# EasyEDA Pro project Circuito Logico NOT.eprj

# Schematic Schematic1

## Sheets
1 P1: Board Name: Board1; Create Date: 2025-03-28; Page Name: P1; Project Name: Circuito Logico NOT; Schematic Name: Schematic1; Update Date: 2025-03-28
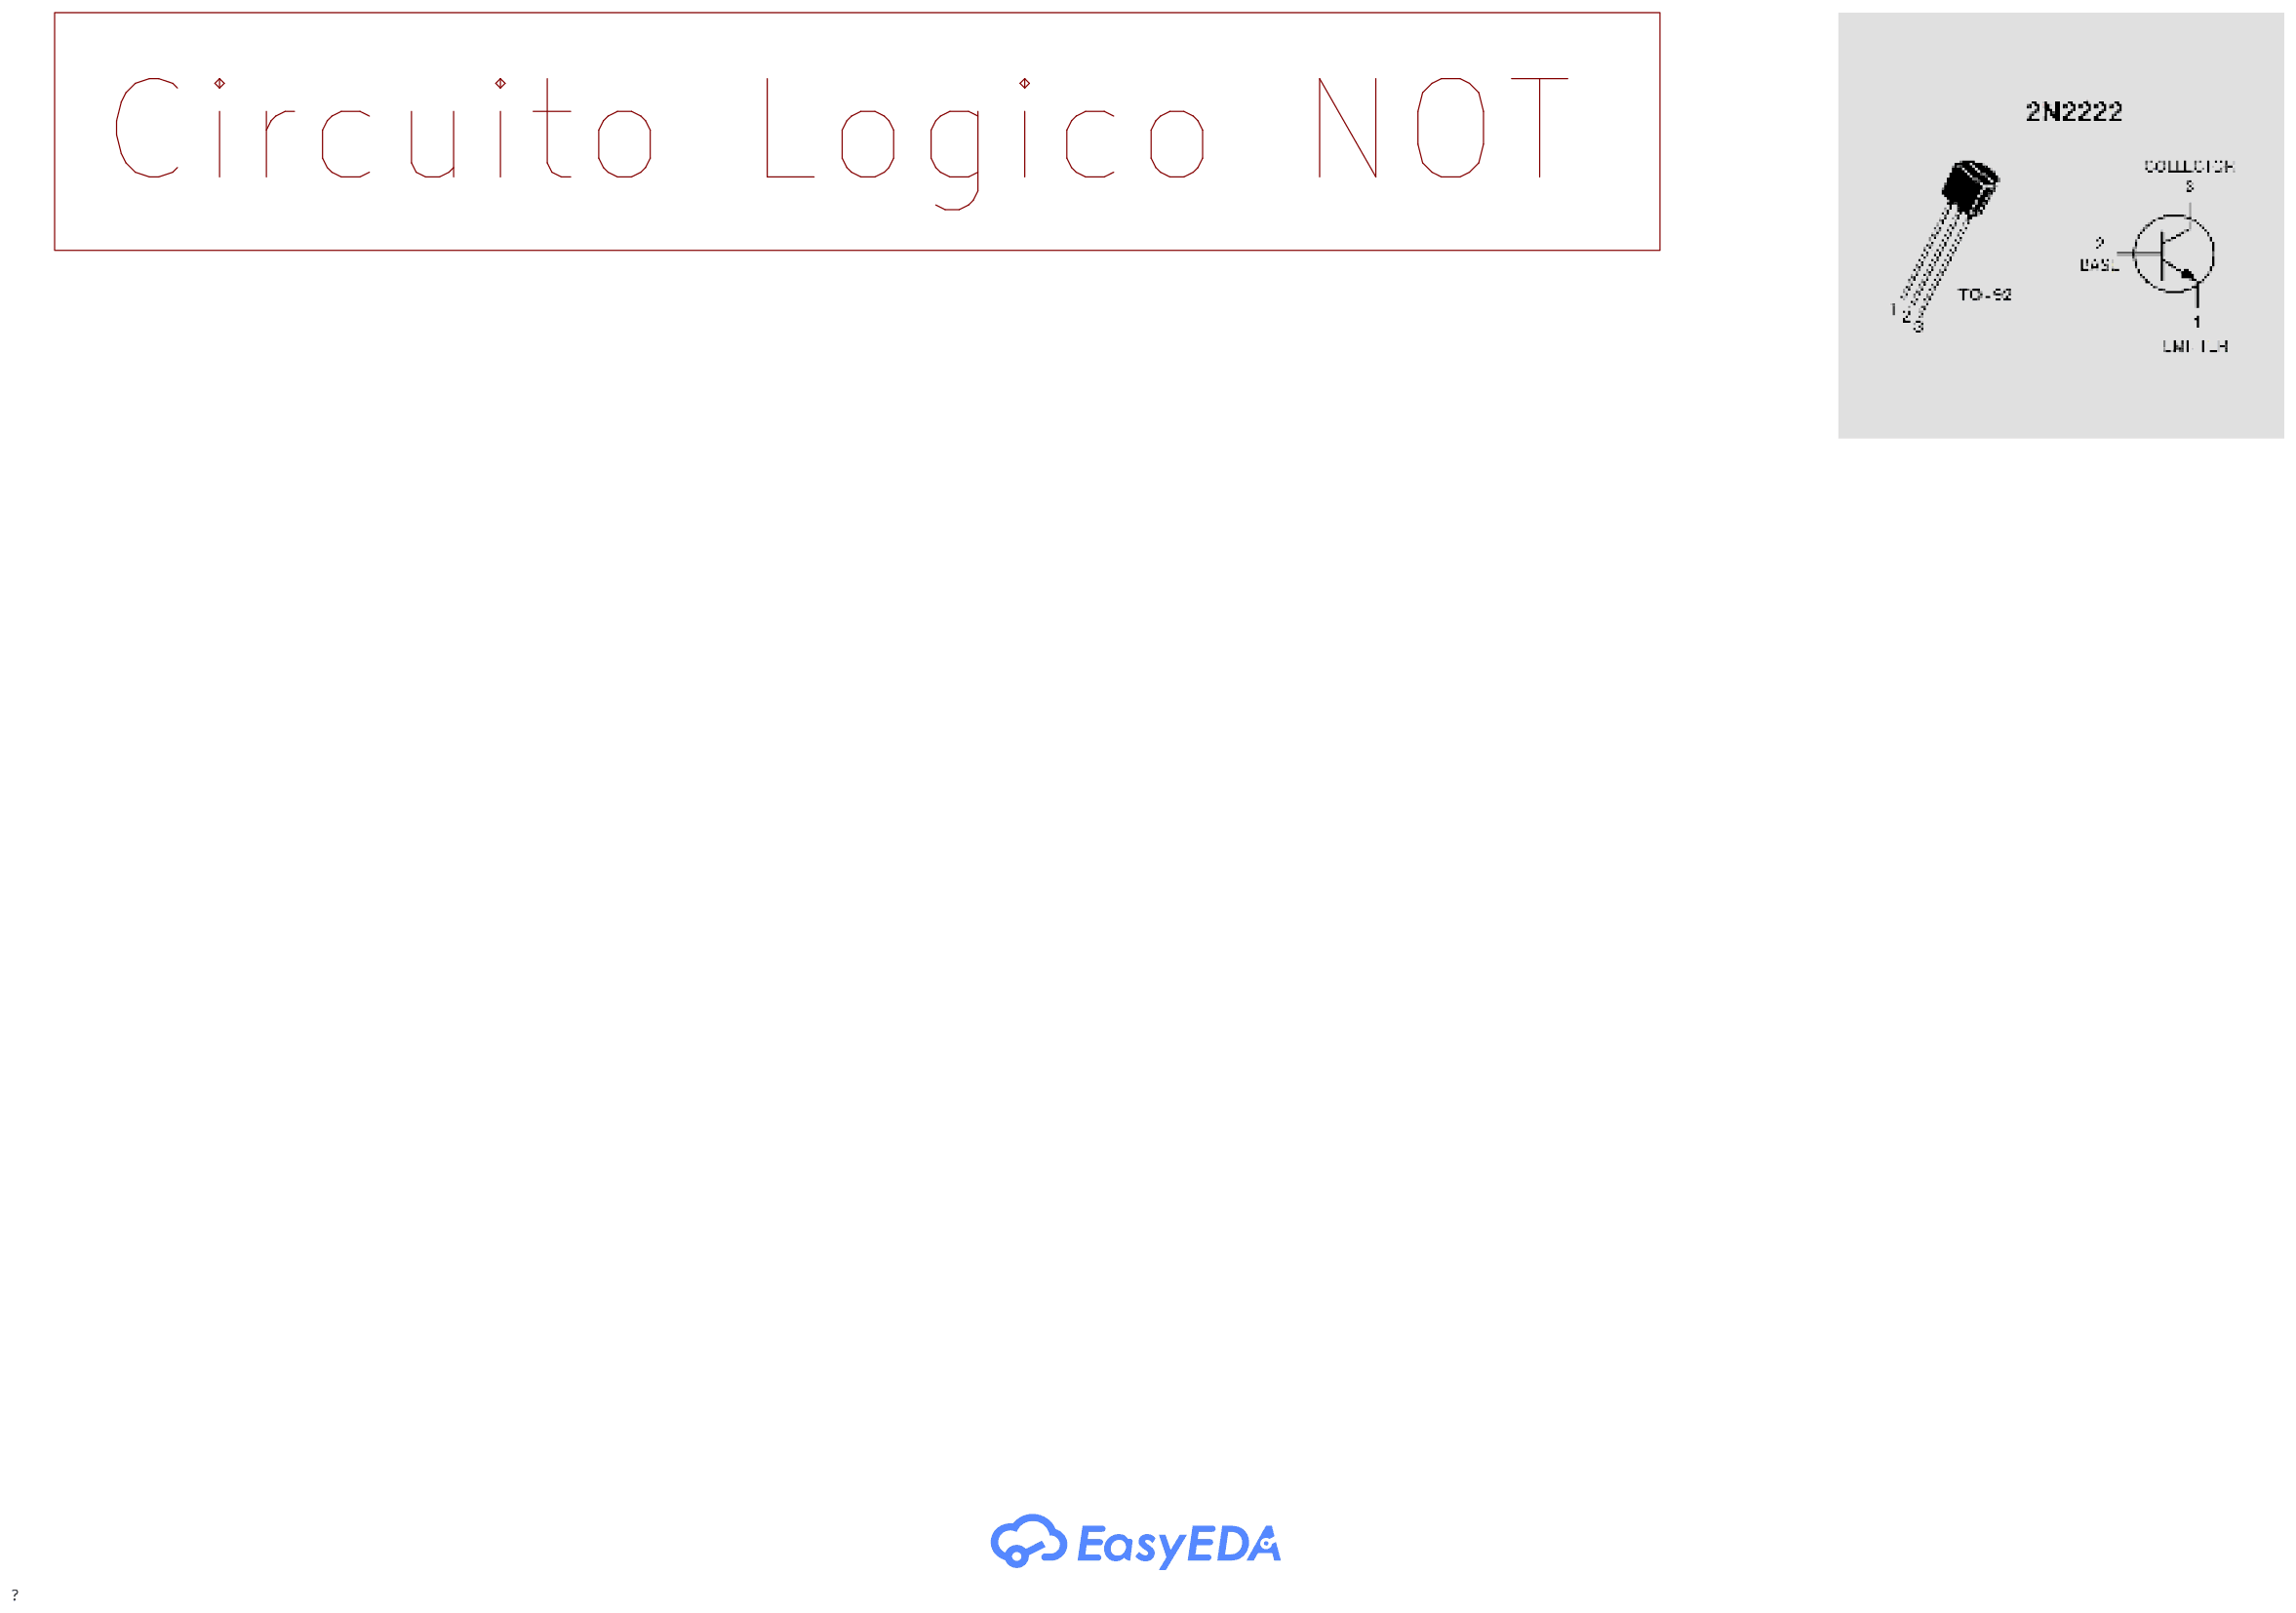
[diagram p0: P1]
2 P2: Page Name: P2
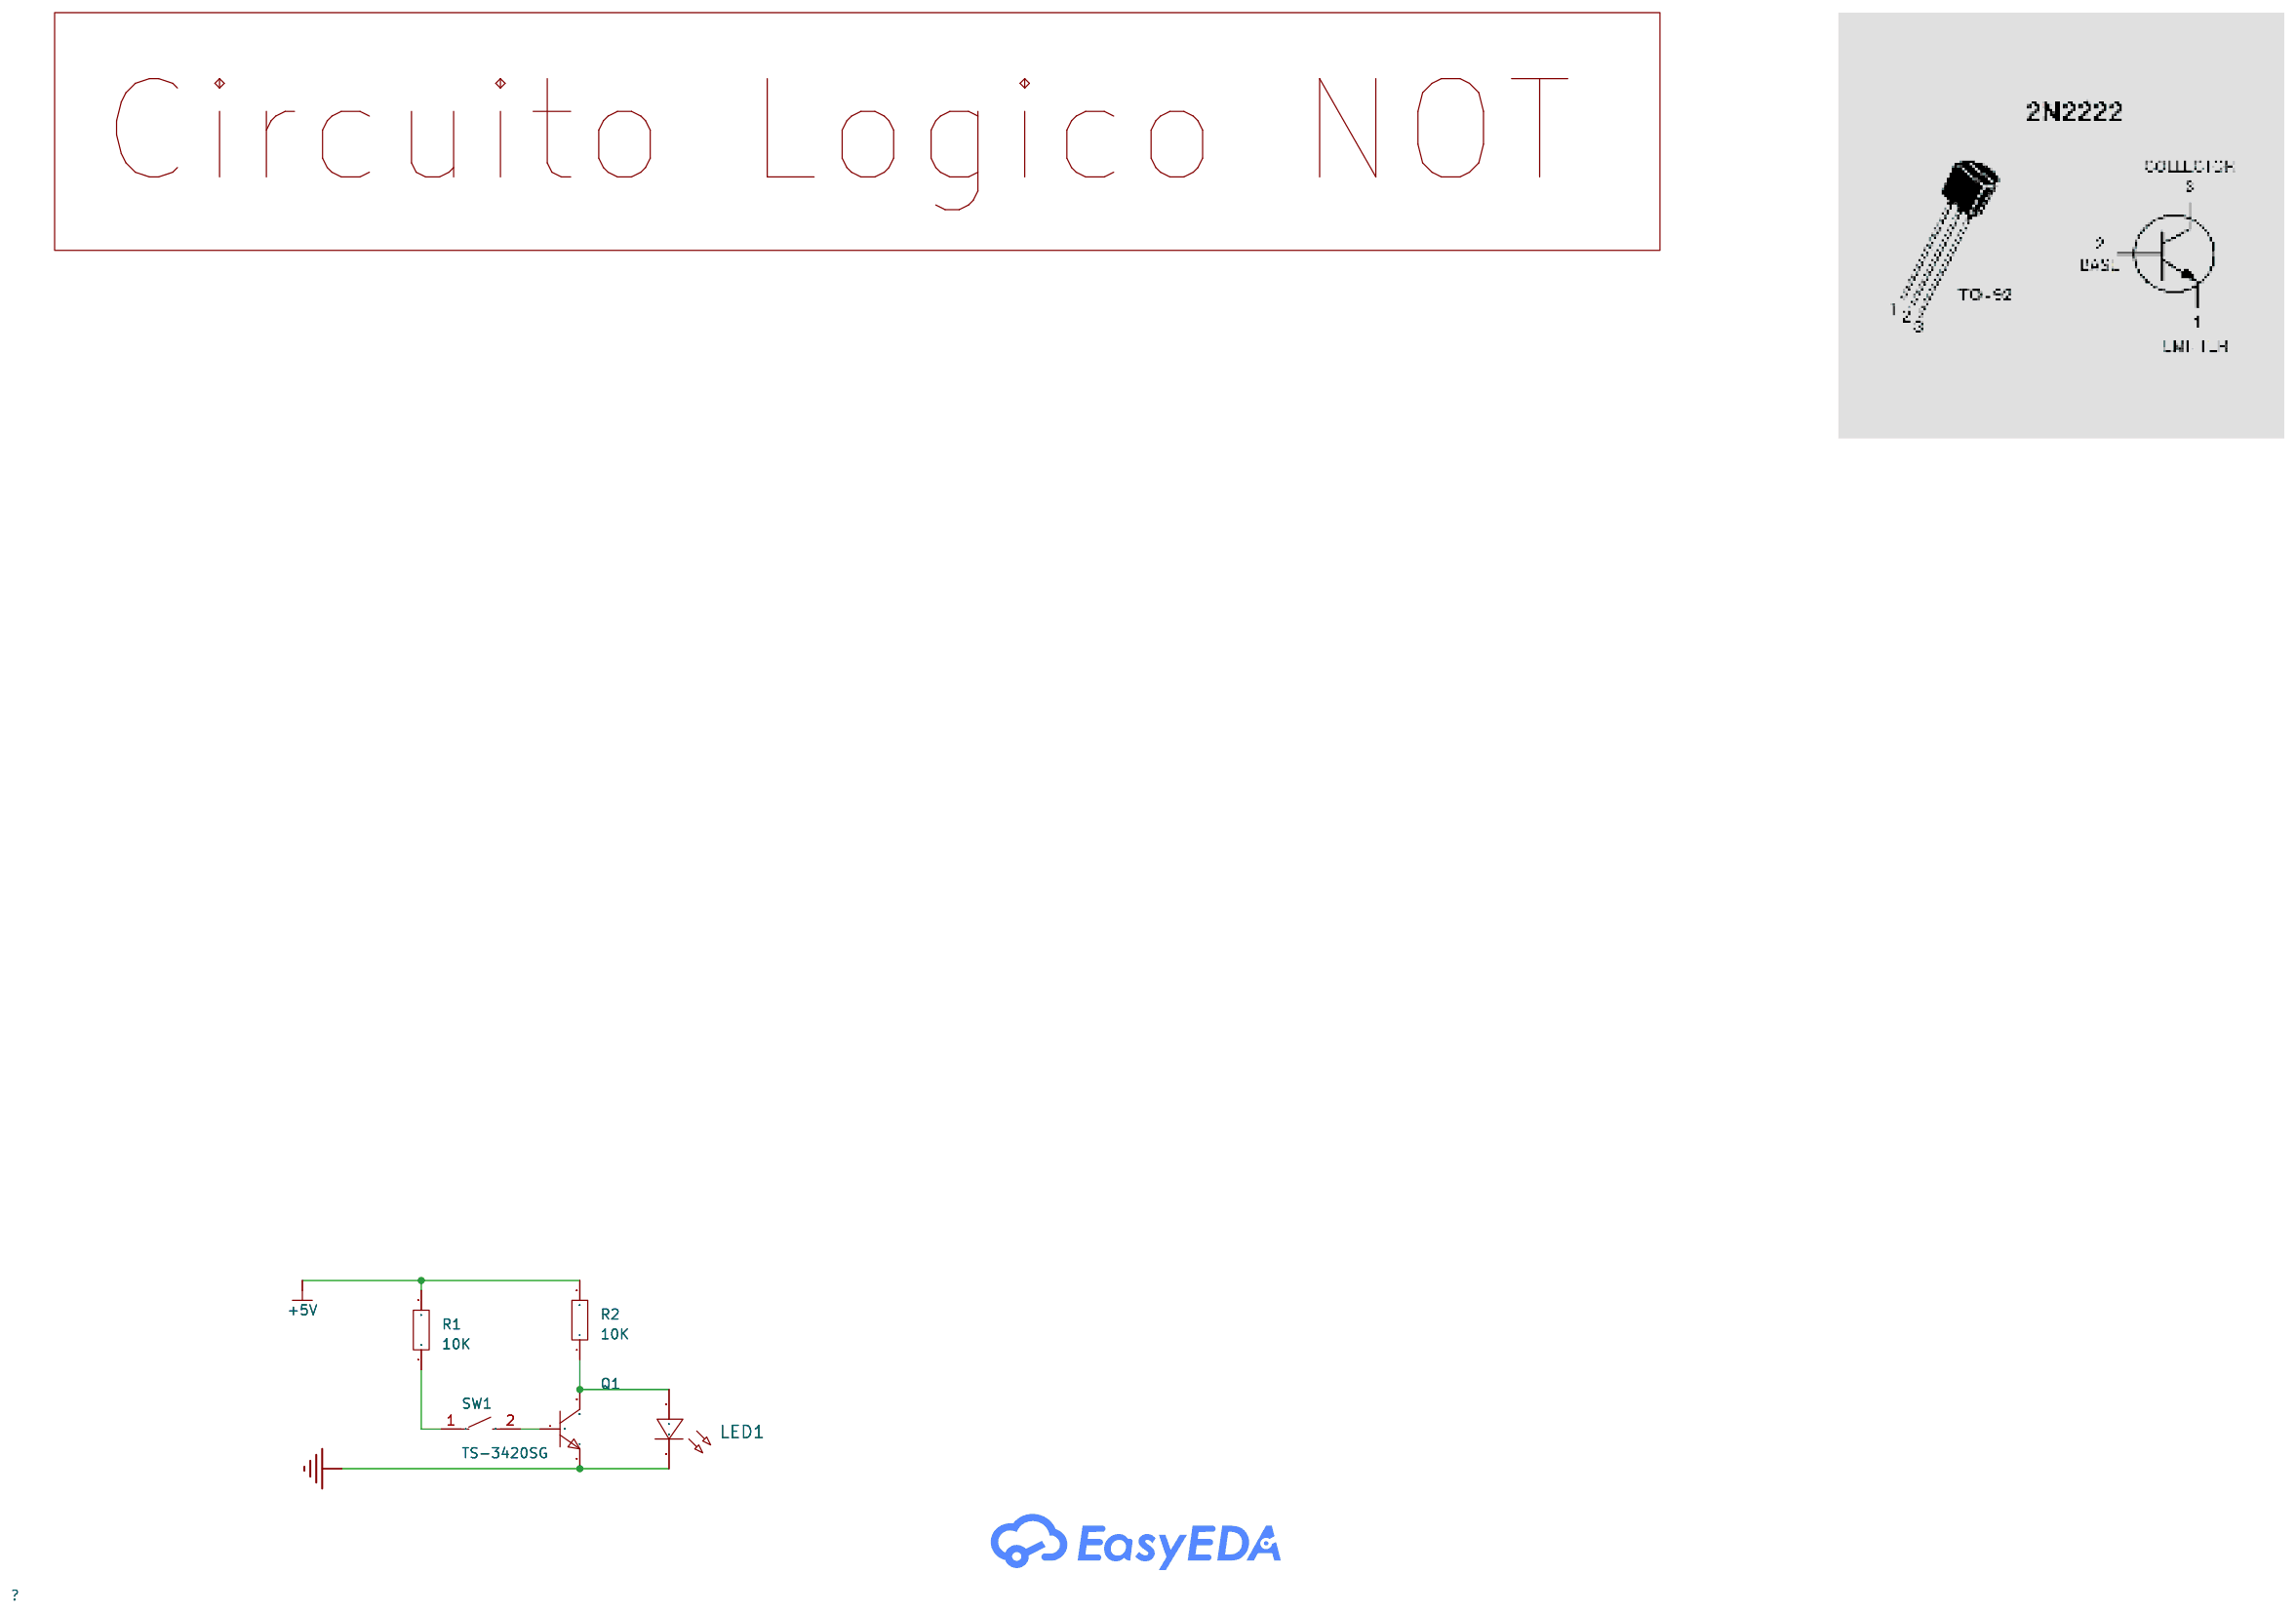
[diagram p1: P2]
3 P3: Page Name: P3
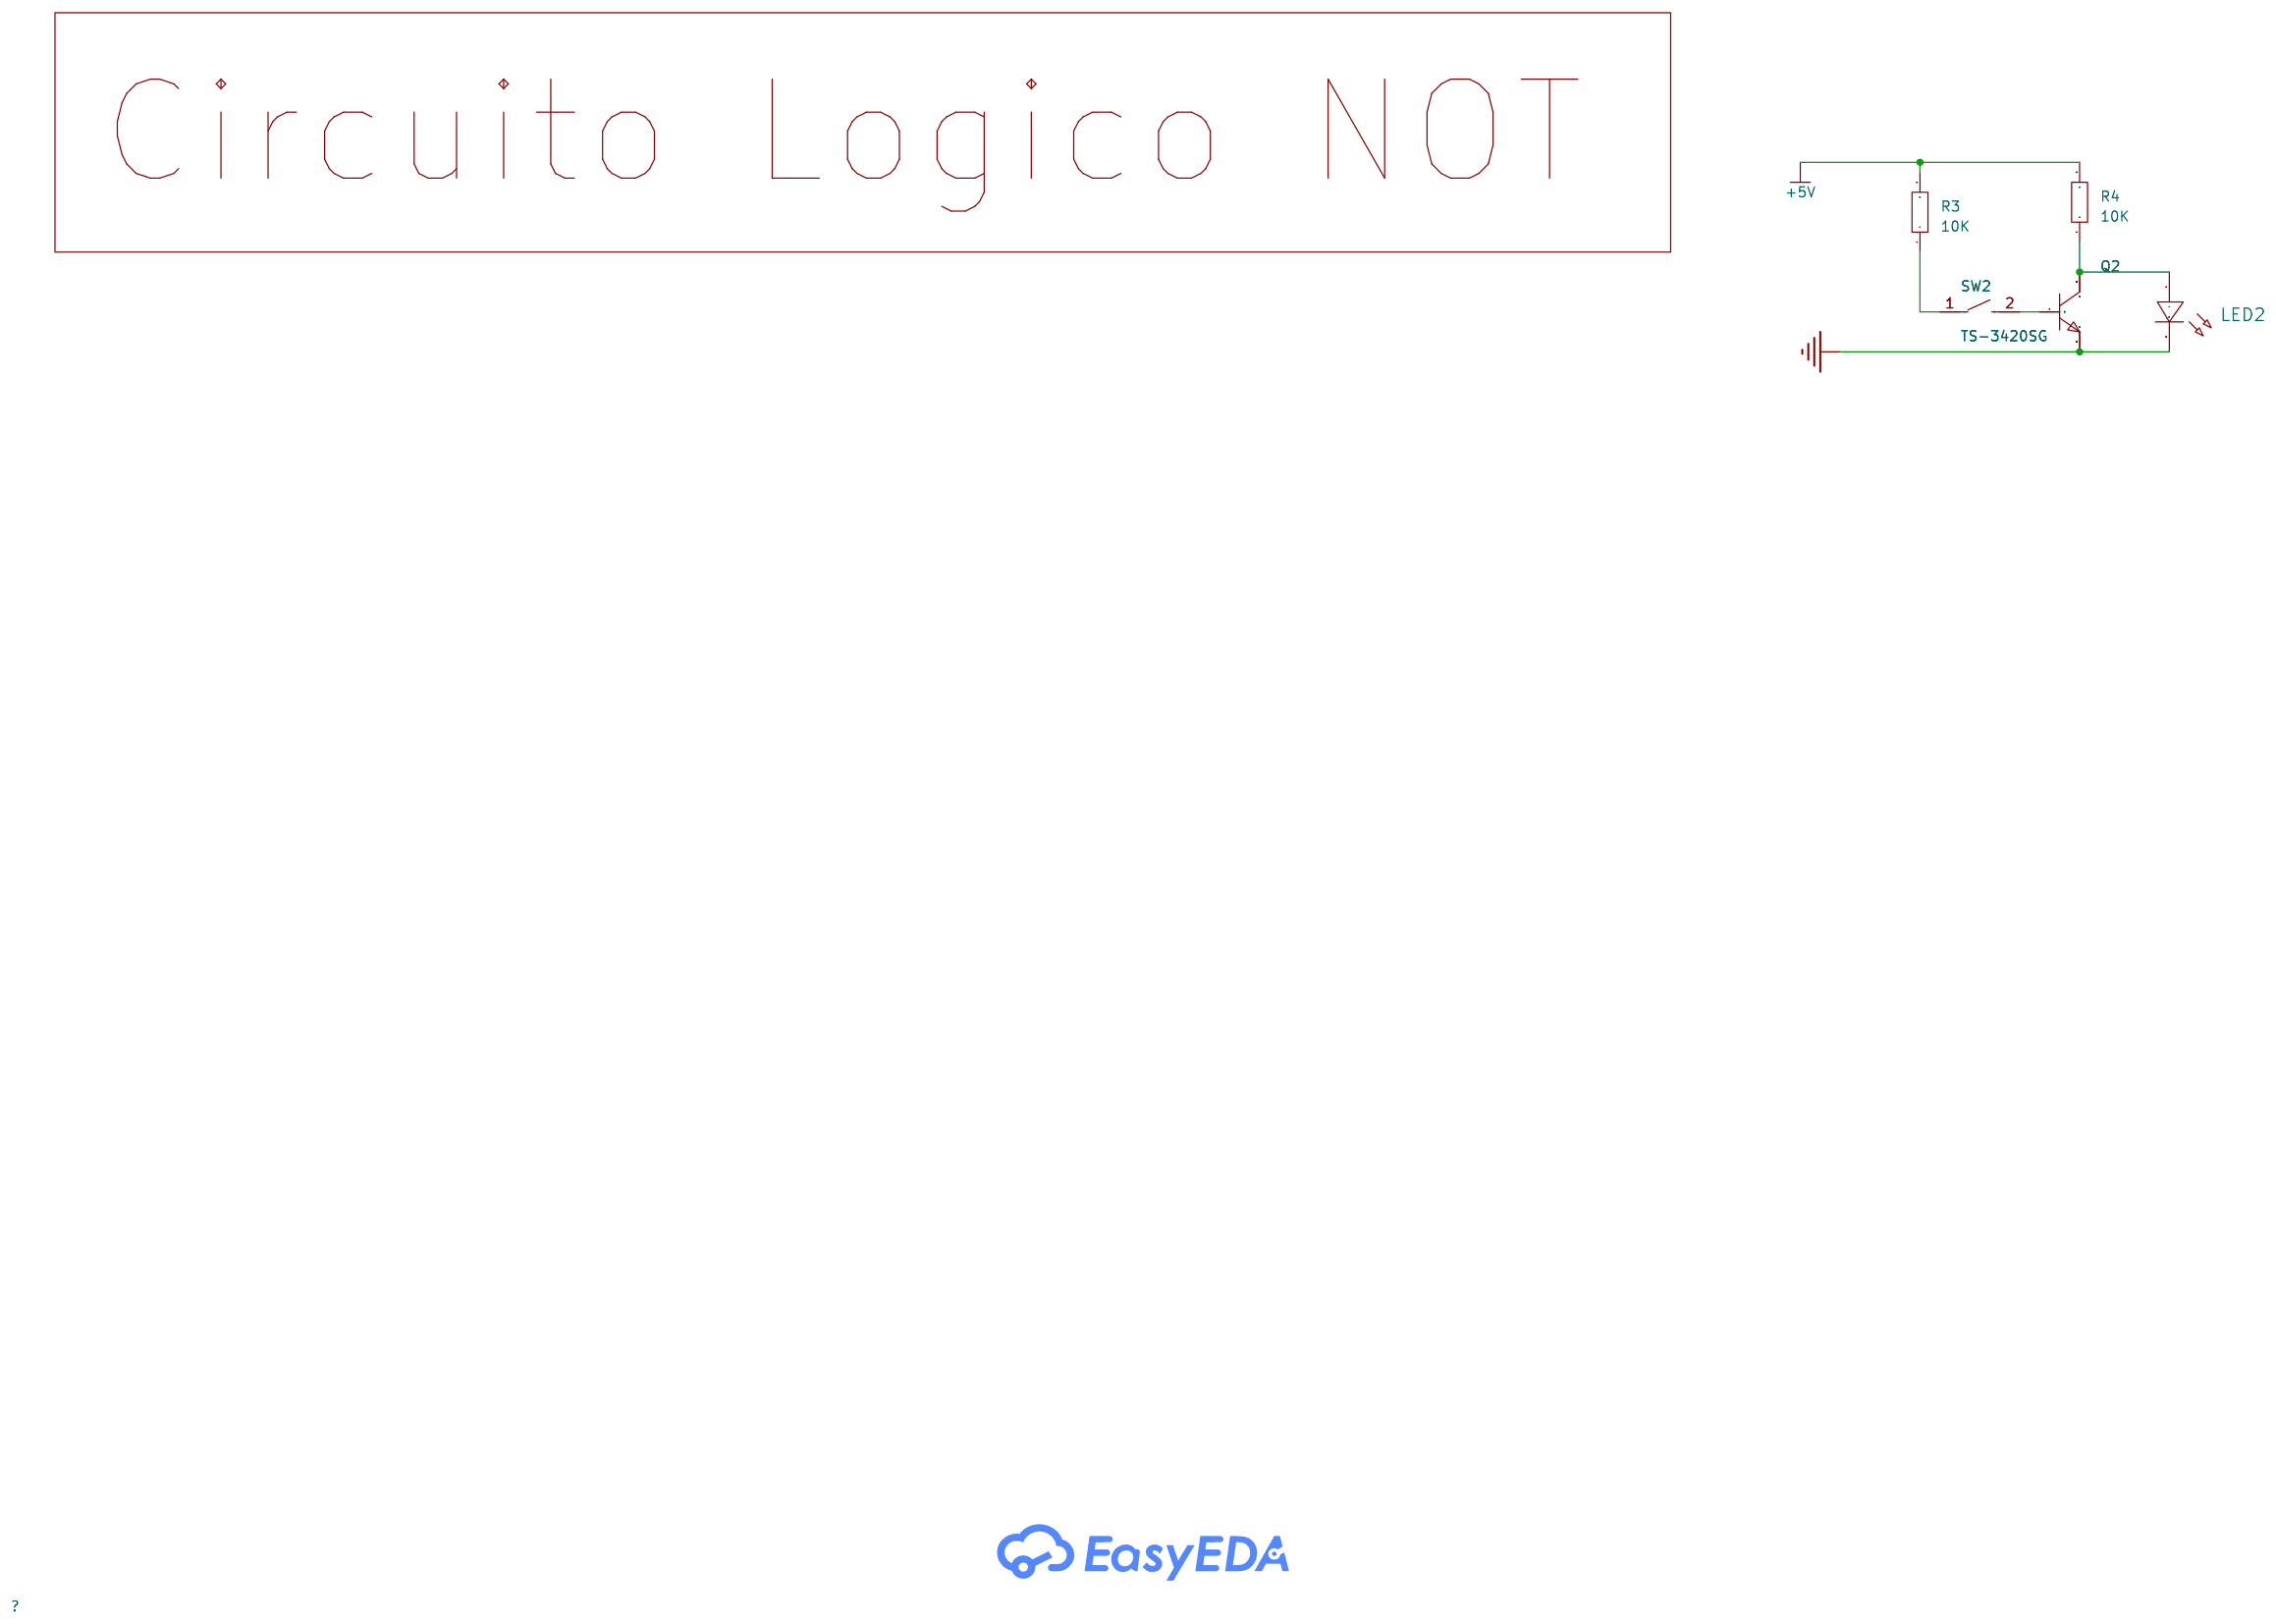
[diagram p2: P3]

## Parts
sheet P2
LED1  -  [LED0402-RD_YELLOW]
Q1  -  [TO-92-3_L4.9-W3.7-P1.27-L]
R1  10K  [R0603]
R2  10K  [R0603]
SW1  TS-3420SG  [SW-SMD_TS-3420SG]
sheet P3
LED2  -  [LED0402-RD_YELLOW]
Q2  -  [TO-92-3_L4.9-W3.7-P1.27-L]
R3  10K  [R0603]
R4  10K  [R0603]
SW2  TS-3420SG  [SW-SMD_TS-3420SG]

## Library data of the parts
LED1 LED2 = LED_0402-R: Supplier Footprint: 0402
Q1 Q2 = S8050_NPN: Supplier Footprint: TO-92
R1-R4 = Res_0603: Supplier Footprint: 0603
SW1 SW2 = TS-3420SG: LCSC Part Name: 3*4*2mm 二脚小龟 轻触开关 黑圆键 弹力250gf 编带; Supplier Part: C19779115; Manufacturer: 康深; Supplier Footprint: SMD,3.9x2.5mm; JLCPCB Part Class: Extended Part; Datasheet: https://atta.szlcsc.com/upload/public/pdf/source/20231226/B2DC8EDDC77954C7935DE5F3966C6317.pdf; Supplier: LCSC; Operating Force: 250gf; Length: 4mm; Width: 3mm; Switch Height: 2mm; Actuator/Cap Color: Black; Life: 50,000 times

## Nets
+5V: R1.2 R2.2 R3.2 R4.2
GND: LED1.2(C) LED2.2(C) Q1.2(E) Q2.2(E)
Net-(LED1-1): LED1.1(A) Q1.3(C) R2.1
Net-(LED2-1): LED2.1(A) Q2.3(C) R4.1
Net-(Q1-1): Q1.1(B) SW1.2
Net-(Q2-1): Q2.1(B) SW2.2
Net-(R1-1): R1.1 SW1.1
Net-(R3-1): R3.1 SW2.1
